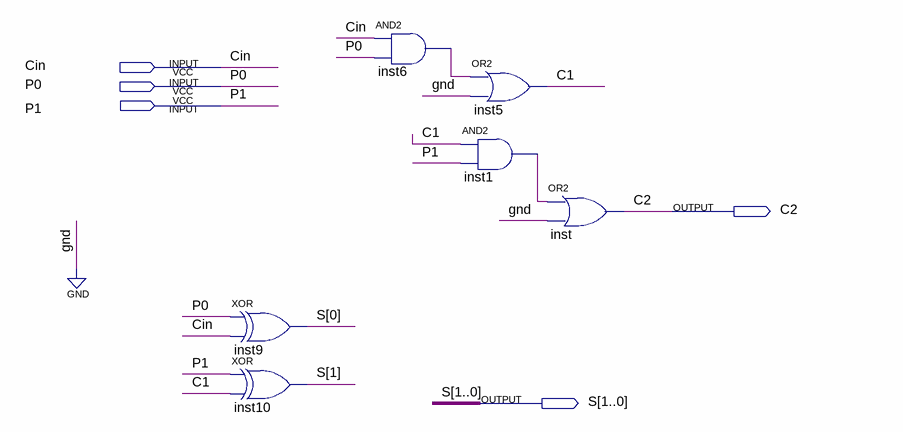
[diagram p0: schematic sheet]
// Quartus schematic Carryo2B.bdf as structural Verilog: 6 symbols, 5 pins
module Carryo2B (
  input  Cin,
  input  P0,
  input  P1,
  output C2,
  output [1:0] S
);

  wire C1, inst1_out, inst6_out;

  xor inst9 (S[0], P0, Cin);
  xor inst10 (S[1], P1, C1);
  and inst6 (inst6_out, Cin, P0);
  or inst5 (C1, inst6_out, 1'b0);
  and inst1 (inst1_out, C1, P1);
  or inst (C2, inst1_out, 1'b0);
endmodule
